# EAGLE schematic uCurrent (EAGLE 7.2.0)
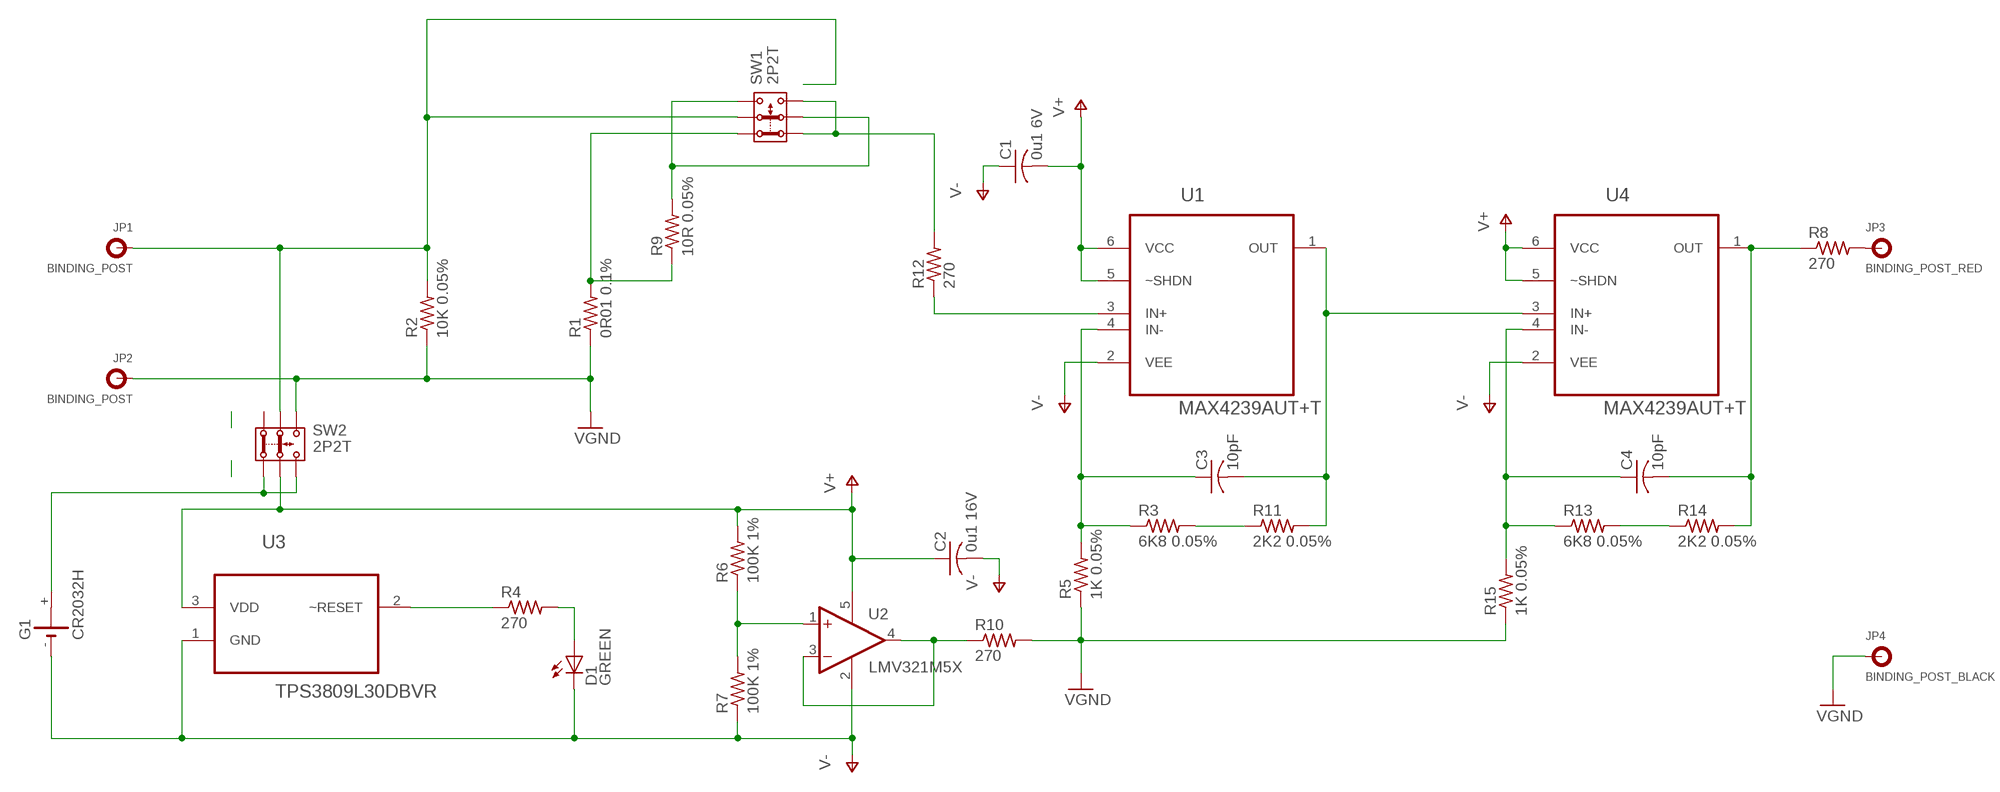
[diagram p0: schematic, sheet 1]

## Parts
C1  0u1 6V  C-USC0402  [C0402]
C2  0u1 16V  C-USC0402  [C0402]
C3  10pF  C-USC0402  [C0402]
C4  10pF  C-USC0402  [C0402]
D1  GREEN  LED3MM  [LED3MM]
G1  CR2032H  [CR2032H]
JP1  BINDING_POST  [BINDING_POST]
JP2  BINDING_POST  [BINDING_POST]
JP3  BINDING_POST_RED  BINDING_POST  [BINDING_POST]
JP4  BINDING_POST_BLACK  BINDING_POST  [BINDING_POST]
R1  0R01 0.1%  R-US_R0402  [R0402]
R2  10K 0.05%  R-US_R0402  [R0402]
R3  6K8 0.05%  R-US_R0402  [R0402]
R4  270  R-US_R0402  [R0402]
R5  1K 0.05%  R-US_R0402  [R0402]
R6  100K 1%  R-US_R0402  [R0402]
R7  100K 1%  R-US_R0402  [R0402]
R8  270  R-US_R0402  [R0402]
R9  10R 0.05%  R-US_R0402  [R0402]
R10  270  R-US_R0402  [R0402]
R11  2K2 0.05%  R-US_R0402  [R0402]
R12  270  R-US_R0402  [R0402]
R13  6K8 0.05%  R-US_R0402  [R0402]
R14  2K2 0.05%  R-US_R0402  [R0402]
R15  1K 0.05%  R-US_R0402  [R0402]
SW1  2P2T  [2P2T]
SW2  2P2T  [2P2T]
U1  MAX4239AUT+T  MAX4237EUT+T  [SOT95P280X145-6N]
U2  LMV321M5X  [SOT23-5]
U3  TPS3809L30DBVR  [SOT95P280X145-3N]
U4  MAX4239AUT+T  MAX4237EUT+T  [SOT95P280X145-6N]

## Nets
N$1: R4.1 U3.2(~RESET)
N$2: R6.1 R7.2 U2.1(+IN)
N$3: D1.A R4.2
N$4: R10.1 U2.3(-IN) U2.4(OUT)
N$5: C3.2 R11.2 U1.1(OUT) U4.3(IN+)
N$6: R3.2 R11.1
N$7: C3.1 R3.1 R5.2 U1.4(IN-)
N$8: C4.2 R8.1 R14.2 U4.1(OUT)
N$9: R13.2 R14.1
N$10: C4.1 R13.1 R15.2 U4.4(IN-)
N$11: R12.1 U1.3(IN+)
N$12: JP3.P$1 R8.2
N$13: JP1.P$1 R2.2 SW1.2.1 SW2.2.1
N$14: R1.2 R9.1 SW1.1.1
N$15: G1.+ SW2.1.2 SW2.3.2
N$16: R12.2 SW1.1.2 SW1.3.2
N$17: R9.2 SW1.2.2 SW1.3.1
V+: C1.2 C2.1 R6.2 SW2.2.2 U1.5(~SHDN) U1.6(VCC) U2.5(V+) U3.3(VDD) U4.5(~SHDN) U4.6(VCC)
V-: C1.1 C2.2 D1.K(C) G1.- R7.1 U1.2(VEE) U2.2(V-) U3.1(GND) U4.2(VEE)
VGND: JP2.P$1 JP4.P$1 R1.1 R2.1 R5.1 R10.2 R15.1 SW2.3.1
Unconnected: G1.+@1(+) SW2.1.1

## Library data of the parts
C1-C4 = rcl:C-US: CAPACITOR, American symbol
D1 = led:LED: LED OSRAM: - CHIPLED LG R971, LG N971, LY N971, LG Q971, LY Q971, LO R971, LY R971 LH N974, LH R974 LS Q976, LO Q976, LY Q976 LO Q996 - Hyper CHIPLED LW Q18S LB Q993, LB Q99A, LB R99A - SideLED LS A670, LO A670, LY A670, LG A670, LP A670 LB A673, LV A673, LT A673, LW A673 LH A674 LY A675 LS A676, LA A676, LO A676, LY A676, LW A676 LS A679, LY A679, LG A679 - Hyper Micro SIDELED® LS Y876, LA Y876, LO Y876, LY Y876 LT Y87S - SmartLED LW L88C, LW L88S LB L89C, LB L89S, LG L890 LS L89K, LO L89K, LY L89K LS L896, LA L896, LO L896, LY L896 - TOPLED LS T670, LO T670, LY T670, LG T670, LP T670 LSG T670, LSP T670, LSY T670, LOP T670, LYG T670 LG T671, LOG T671, LSG T671 LB T673, LV T673, LT T673, LW T673 LH T674 LS T676, LA T676, LO T676, LY T676, LB T676, LH T676, LSB T676, LW T676 LB T67C, LV T67C, LT T67C, LS T67K, LO T67K, LY T67K, LW E67C LS E67B, LA E67B, LO E67B, LY E67B, LB E67C, LV E67C, LT E67C LW T67C LS T679, LY T679, LG T679 LS T770, LO T770, LY T770, LG T770, LP T770 LB T773, LV T773, LT T773, LW T773 LH T774 LS E675, LA E675, LY E675, LS T675 LS T776, LA T776, LO T776, LY T776, LB T776 LHGB T686 LT T68C, LB T68C - Hyper Mini TOPLED® LB M676 - Mini TOPLED Santana® LG M470 LS M47K, LO M47K, LY M47K Source: http://www.osram.convergy.de LUXEON: - LUMILED® LXK2-PW12-R00, LXK2-PW12-S00, LXK2-PW14-U00, LXK2-PW14-V00 LXK2-PM12-R00, LXK2-PM12-S00, LXK2-PM14-U00 LXK2-PE12-Q00, LXK2-PE12-R00, LXK2-PE12-S00, LXK2-PE14-T00, LXK2-PE14-U00 LXK2-PB12-K00, LXK2-PB12-L00, LXK2-PB12-M00, LXK2-PB14-N00, LXK2-PB14-P00, LXK2-PB14-Q00 LXK2-PR12-L00, LXK2-PR12-M00, LXK2-PR14-Q00, LXK2-PR14-R00 LXK2-PD12-Q00, LXK2-PD12-R00, LXK2-PD12-S00 LXK2-PH12-R00, LXK2-PH12-S00 LXK2-PL12-P00, LXK2-PL12-Q00, LXK2-PL12-R00 Source: www.luxeon.com KINGBRIGHT: KA-3528ASYC Source: www.kingbright.com
G1 = battery:CR2032H: LI BATTERY Varta
JP1-JP4 = SparkFun-Connectors:BINDING_POST: Single Banana jack. PRT-09739 (red) or PRT-09740 (blk) Footprint is a bit strange. The component itself has an threaded, insulated body that goes through the board, with a small threaded metal stud coming off the back. The intent of this package is that the post goes through a milled obling hole, and a small wire would be used to connect from the PCB pad to the metal contact on the post.
R1-R15 = rcl:R-US_: RESISTOR, American symbol
SW1 SW2 = switch:2P2T: SLIDE SWITCH 2P2T Part No. SS-22F05-G(A)4 Source: CANAL ELECTRONIC CO., LTD .. switsch.pdf
U1 U4 = Maxim_By_element14_Batch_1:MAX4237EUT+T: Very High Precision, 3V/5V Rail-to-Rail Op Amps; MPN: MAX4237EUT+T; OC_FARNELL: 1609597; OC_NEWARK: -; PACKAGE: SOT-23-6; SUPPLIER: Maxim
U2 = linear:LMV321?*: General Purpose, Low Voltage, Rail-to-Rail Output Operational Amplifiers Source: http://www.national.com/mpf/LM/LMV321.html http://www.national.com/dt/lmv_qual.pdf
U3 = Texas Instruments_By_element14_Batch_1:TPS3809L30DBVR: VOLTAGE SUPERVISORS; MPN: TPS3809L30DBVR; OC_FARNELL: 1535757; OC_NEWARK: 77C0403; PACKAGE: SOT23-3; SUPPLIER: Texas Instruments